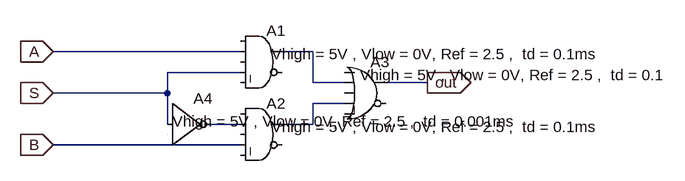
[diagram p0: schematic 2_1_mux.asc]
2_1_mux.asc, the LTspice schematic file:
Version 4
SHEET 1 880 840
WIRE 160 80 -128 80
WIRE 272 80 224 80
WIRE 160 112 48 112
WIRE 272 128 272 80
WIRE 320 128 272 128
WIRE 448 128 384 128
WIRE 48 144 48 112
WIRE 48 144 -128 144
WIRE 320 160 272 160
WIRE 48 192 48 144
WIRE 160 192 112 192
WIRE 272 192 272 160
WIRE 272 192 224 192
WIRE 160 224 -128 224
FLAG 448 128 out
IOPIN 448 128 Out
FLAG -128 80 A
IOPIN -128 80 In
FLAG -128 144 S
IOPIN -128 144 In
FLAG -128 224 B
IOPIN -128 224 In
SYMBOL Digital\\and 192 32 R0
WINDOW 3 16 52 Left 2
SYMATTR InstName A1
SYMATTR Value Vhigh = 5V , Vlow = 0V, Ref = 2.5 ,  td = 0.1ms
SYMBOL Digital\\and 192 144 R0
WINDOW 3 16 52 Left 2
SYMATTR InstName A2
SYMATTR Value Vhigh = 5V , Vlow = 0V, Ref = 2.5 ,  td = 0.1ms
SYMBOL Digital\\or 352 80 R0
WINDOW 3 -8 36 Left 2
SYMATTR InstName A3
SYMATTR Value Vhigh = 5V , Vlow = 0V, Ref = 2.5 ,  td = 0.1
SYMBOL Digital\\inv 48 128 R0
WINDOW 3 8 60 Left 2
SYMATTR InstName A4
SYMATTR Value Vhigh = 5V , Vlow = 0V, Ref = 2.5 ,  td = 0.001ms

The netlist it stands for:
* 2_1_mux.asc
A1 0 A 0 S 0 0 N001 0 AND Vhigh = 5V , Vlow = 0V, Ref = 2.5 ,  td = 0.1ms
A2 0 N003 0 B 0 0 N002 0 AND Vhigh = 5V , Vlow = 0V, Ref = 2.5 ,  td = 0.1ms
A3 0 N001 0 N002 0 0 out 0 OR Vhigh = 5V , Vlow = 0V, Ref = 2.5 ,  td = 0.1
A4 S 0 0 0 0 N003 0 0 BUF Vhigh = 5V , Vlow = 0V, Ref = 2.5 ,  td = 0.001ms
.backanno
.end